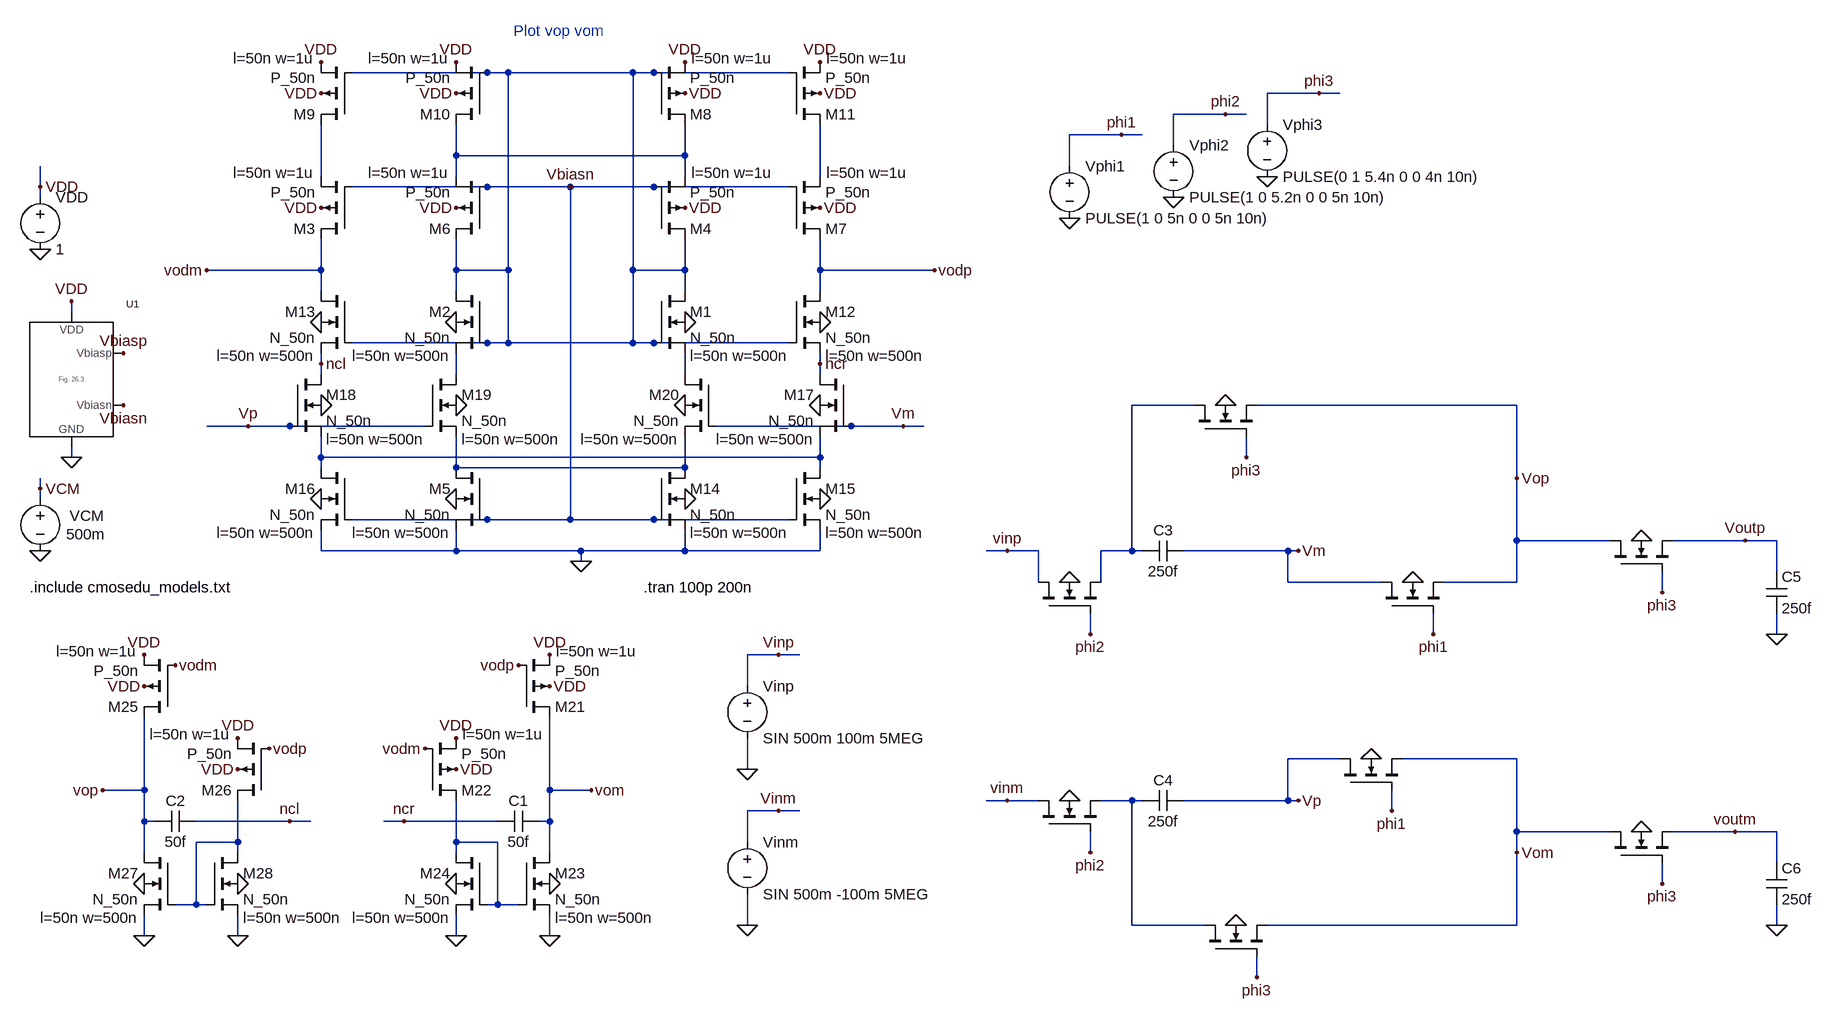
[diagram p0: schematic Fig26_25.asc]
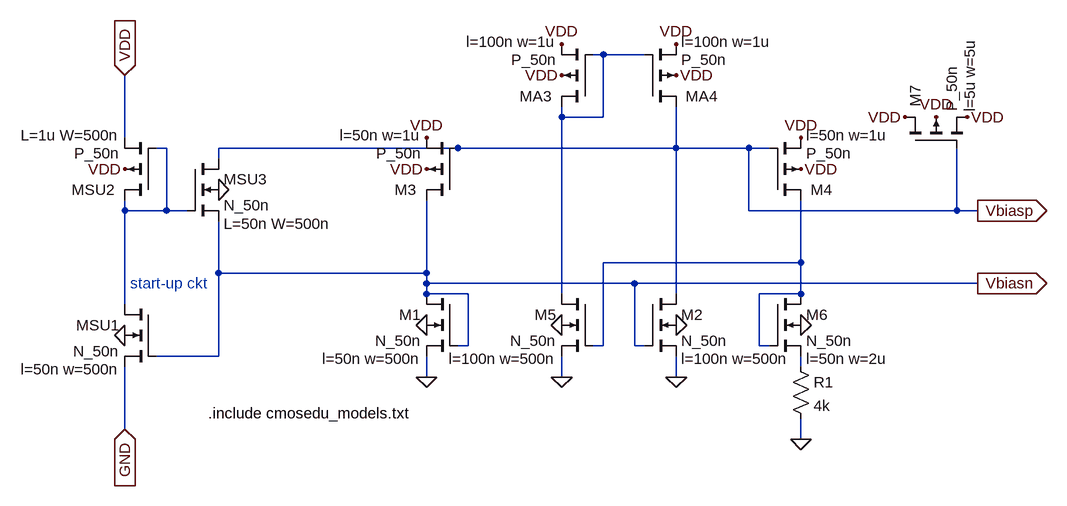
[diagram p1: sub-circuit fig_26_3.asc]
Fig26_25.asc, the LTspice schematic file:
Version 4
SHEET 1 3488 992
WIRE 1440 -544 1232 -544
WIRE 1472 -544 1440 -544
WIRE 1664 -544 1472 -544
WIRE 1696 -544 1664 -544
WIRE 1904 -544 1696 -544
WIRE 2720 -512 2640 -512
WIRE 2752 -512 2720 -512
WIRE 2576 -480 2496 -480
WIRE 2608 -480 2576 -480
WIRE 2640 -464 2640 -512
WIRE 2416 -448 2336 -448
WIRE 2448 -448 2416 -448
WIRE 2496 -432 2496 -480
WIRE 1392 -416 1392 -464
WIRE 1744 -416 1744 -464
WIRE 1744 -416 1392 -416
WIRE 2336 -400 2336 -448
WIRE 1184 -384 1184 -464
WIRE 1392 -384 1392 -416
WIRE 1744 -384 1744 -416
WIRE 1952 -384 1952 -464
WIRE 752 -368 752 -400
WIRE 1440 -368 1232 -368
WIRE 1568 -368 1440 -368
WIRE 1696 -368 1568 -368
WIRE 1904 -368 1696 -368
WIRE 752 -352 752 -368
WIRE 1184 -240 1184 -288
WIRE 1184 -240 1008 -240
WIRE 1392 -240 1392 -288
WIRE 1472 -240 1472 -544
WIRE 1472 -240 1392 -240
WIRE 1664 -240 1664 -544
WIRE 1744 -240 1744 -288
WIRE 1744 -240 1664 -240
WIRE 1952 -240 1952 -288
WIRE 2128 -240 1952 -240
WIRE 1184 -208 1184 -240
WIRE 1392 -208 1392 -240
WIRE 1744 -208 1744 -240
WIRE 1952 -208 1952 -240
WIRE 800 -176 800 -192
WIRE 1440 -128 1232 -128
WIRE 1472 -128 1472 -240
WIRE 1472 -128 1440 -128
WIRE 1664 -128 1664 -240
WIRE 1664 -128 1472 -128
WIRE 1696 -128 1664 -128
WIRE 1904 -128 1696 -128
WIRE 1184 -96 1184 -112
WIRE 1952 -96 1952 -112
WIRE 1184 -80 1184 -96
WIRE 1392 -80 1392 -112
WIRE 1744 -80 1744 -112
WIRE 1952 -80 1952 -96
WIRE 2528 -32 2432 -32
WIRE 3024 -32 2624 -32
WIRE 1072 0 1008 0
WIRE 1136 0 1072 0
WIRE 1344 0 1136 0
WIRE 2000 0 1792 0
WIRE 2080 0 2000 0
WIRE 2112 0 2080 0
WIRE 800 48 800 32
WIRE 1184 48 1184 16
WIRE 1952 48 1952 16
WIRE 1952 48 1184 48
WIRE 2608 48 2608 16
WIRE 1184 64 1184 48
WIRE 1392 64 1392 16
WIRE 1744 64 1744 16
WIRE 1744 64 1392 64
WIRE 1952 64 1952 48
WIRE 3024 80 3024 -32
WIRE 752 96 752 80
WIRE 752 112 752 96
WIRE 1440 144 1232 144
WIRE 1568 144 1568 -368
WIRE 1568 144 1440 144
WIRE 1696 144 1568 144
WIRE 1904 144 1696 144
WIRE 3024 176 3024 80
WIRE 3168 176 3024 176
WIRE 3376 176 3264 176
WIRE 3424 176 3376 176
WIRE 1184 192 1184 160
WIRE 1392 192 1392 160
WIRE 1392 192 1184 192
WIRE 1584 192 1392 192
WIRE 1744 192 1744 160
WIRE 1744 192 1584 192
WIRE 1952 192 1952 160
WIRE 1952 192 1744 192
WIRE 2240 192 2208 192
WIRE 2288 192 2240 192
WIRE 2432 192 2432 -32
WIRE 2432 192 2384 192
WIRE 2448 192 2432 192
WIRE 2672 192 2512 192
WIRE 2688 192 2672 192
WIRE 1584 208 1584 192
WIRE 3424 224 3424 176
WIRE 2288 240 2288 192
WIRE 2384 240 2384 192
WIRE 2672 240 2672 192
WIRE 2816 240 2672 240
WIRE 3024 240 3024 176
WIRE 3024 240 2912 240
WIRE 3248 256 3248 224
WIRE 2368 320 2368 288
WIRE 2896 320 2896 288
WIRE 3424 320 3424 288
WIRE 1888 352 1840 352
WIRE 1920 352 1888 352
WIRE 1840 400 1840 352
WIRE 2752 512 2672 512
WIRE 3024 512 2848 512
WIRE 1840 528 1840 480
WIRE 912 560 912 448
WIRE 912 560 848 560
WIRE 1536 560 1536 448
WIRE 1600 560 1536 560
WIRE 2240 576 2208 576
WIRE 2288 576 2240 576
WIRE 2432 576 2384 576
WIRE 2448 576 2432 576
WIRE 2672 576 2672 512
WIRE 2672 576 2512 576
WIRE 2688 576 2672 576
WIRE 1888 592 1840 592
WIRE 1920 592 1888 592
WIRE 2832 592 2832 560
WIRE 912 608 912 560
WIRE 928 608 912 608
WIRE 1136 608 992 608
WIRE 1168 608 1136 608
WIRE 1312 608 1280 608
WIRE 1456 608 1312 608
WIRE 1536 608 1536 560
WIRE 1536 608 1520 608
WIRE 3024 624 3024 512
WIRE 3168 624 3024 624
WIRE 3360 624 3264 624
WIRE 3424 624 3360 624
WIRE 1056 640 1056 576
WIRE 1056 640 992 640
WIRE 1392 640 1392 576
WIRE 1456 640 1392 640
WIRE 1840 640 1840 592
WIRE 912 656 912 608
WIRE 1056 656 1056 640
WIRE 1392 656 1392 640
WIRE 1536 656 1536 608
WIRE 2368 656 2368 624
WIRE 3024 656 3024 624
WIRE 3424 672 3424 624
WIRE 3248 704 3248 672
WIRE 992 736 992 640
WIRE 992 736 960 736
WIRE 1008 736 992 736
WIRE 1456 736 1456 640
WIRE 1456 736 1440 736
WIRE 1488 736 1456 736
WIRE 1840 768 1840 720
WIRE 2432 768 2432 576
WIRE 2544 768 2432 768
WIRE 3024 768 3024 656
WIRE 3024 768 2640 768
WIRE 3424 768 3424 736
WIRE 912 784 912 752
WIRE 1056 784 1056 752
WIRE 1392 784 1392 752
WIRE 1536 784 1536 752
WIRE 2624 848 2624 816
FLAG 752 -272 0
FLAG 752 -368 VDD
FLAG 1392 -160 0
FLAG 1744 -160 0
FLAG 1744 -336 VDD
FLAG 1184 -336 VDD
FLAG 800 -192 VDD
FLAG 800 48 0
FLAG 752 192 0
FLAG 880 -32 Vbiasn
FLAG 880 -112 Vbiasp
FLAG 752 96 VCM
FLAG 1392 -336 VDD
FLAG 1952 -336 VDD
FLAG 1744 -560 VDD
FLAG 1744 -512 VDD
FLAG 1184 -512 VDD
FLAG 1184 -560 VDD
FLAG 1392 -512 VDD
FLAG 1392 -560 VDD
FLAG 1952 -560 VDD
FLAG 1952 -512 VDD
FLAG 1952 -160 0
FLAG 1184 -160 0
FLAG 1392 112 0
FLAG 1744 112 0
FLAG 1952 112 0
FLAG 1184 112 0
FLAG 1952 -32 0
FLAG 1184 -32 0
FLAG 1392 -32 0
FLAG 1744 -32 0
FLAG 1584 208 0
FLAG 1568 -368 Vbiasn
FLAG 2128 -240 vodp
FLAG 1008 -240 vodm
FLAG 1072 0 Vp
FLAG 2080 0 Vm
FLAG 1952 -96 ncr
FLAG 1184 -96 ncl
FLAG 1536 352 VDD
FLAG 1536 400 VDD
FLAG 1392 480 VDD
FLAG 1392 528 VDD
FLAG 1536 704 0
FLAG 1536 784 0
FLAG 1392 704 0
FLAG 1392 784 0
FLAG 1600 560 vom
FLAG 1312 608 ncr
FLAG 1488 368 vodp
FLAG 1344 496 vodm
FLAG 912 352 VDD
FLAG 912 400 VDD
FLAG 1056 480 VDD
FLAG 1056 528 VDD
FLAG 912 704 0
FLAG 912 784 0
FLAG 1056 704 0
FLAG 1056 784 0
FLAG 848 560 vop
FLAG 1136 608 ncl
FLAG 960 368 vodm
FLAG 1104 496 vodp
FLAG 1840 528 0
FLAG 1888 352 Vinp
FLAG 1840 768 0
FLAG 1888 592 Vinm
FLAG 2336 240 0
FLAG 2368 320 phi2
FLAG 2240 192 vinp
FLAG 2336 576 0
FLAG 2368 656 phi2
FLAG 2240 576 vinm
FLAG 2688 192 Vm
FLAG 2688 576 Vp
FLAG 2576 -32 0
FLAG 2608 48 phi3
FLAG 2592 768 0
FLAG 2624 848 phi3
FLAG 2864 240 0
FLAG 2896 320 phi1
FLAG 2800 512 0
FLAG 2832 592 phi1
FLAG 3024 80 Vop
FLAG 3024 656 Vom
FLAG 3216 176 0
FLAG 3248 256 phi3
FLAG 3216 624 0
FLAG 3248 704 phi3
FLAG 3424 320 0
FLAG 3424 768 0
FLAG 3376 176 Voutp
FLAG 3360 624 voutm
FLAG 2336 -320 0
FLAG 2416 -448 phi1
FLAG 2496 -352 0
FLAG 2576 -480 phi2
FLAG 2640 -384 0
FLAG 2720 -512 phi3
SYMBOL voltage 752 -368 R0
WINDOW 123 0 0 Left 2
WINDOW 39 0 0 Left 2
SYMATTR InstName VDD
SYMATTR Value 1
SYMBOL nmos4 1440 -208 M0
WINDOW 123 56 100 Left 2
SYMATTR Value2 l=50n w=500n
SYMATTR InstName M2
SYMATTR Value N_50n
SYMBOL nmos4 1696 -208 R0
WINDOW 123 56 100 Left 2
SYMATTR Value2 l=50n w=500n
SYMATTR InstName M1
SYMATTR Value N_50n
SYMBOL pmos4 1696 -288 M180
WINDOW 123 58 102 Left 2
WINDOW 0 56 16 Left 2
SYMATTR Value2 l=50n w=1u
SYMATTR InstName M4
SYMATTR Value P_50n
SYMBOL pmos4 1232 -288 R180
WINDOW 123 58 102 Left 2
WINDOW 0 56 16 Left 2
SYMATTR Value2 l=50n w=1u
SYMATTR InstName M3
SYMATTR Value P_50n
SYMBOL voltage 752 96 R0
WINDOW 0 45 42 Left 2
WINDOW 3 40 70 Left 2
WINDOW 123 0 0 Left 2
WINDOW 39 0 0 Left 2
SYMATTR InstName VCM
SYMATTR Value 500m
SYMBOL Fig_26_3 736 -64 R0
SYMATTR InstName U1
SYMBOL pmos4 1440 -288 R180
WINDOW 123 58 102 Left 2
WINDOW 0 56 16 Left 2
SYMATTR Value2 l=50n w=1u
SYMATTR InstName M6
SYMATTR Value P_50n
SYMBOL pmos4 1904 -288 M180
WINDOW 123 58 102 Left 2
WINDOW 0 56 16 Left 2
SYMATTR Value2 l=50n w=1u
SYMATTR InstName M7
SYMATTR Value P_50n
SYMBOL pmos4 1696 -464 M180
WINDOW 123 58 102 Left 2
WINDOW 0 56 16 Left 2
SYMATTR Value2 l=50n w=1u
SYMATTR InstName M8
SYMATTR Value P_50n
SYMBOL pmos4 1232 -464 R180
WINDOW 123 58 102 Left 2
WINDOW 0 56 16 Left 2
SYMATTR Value2 l=50n w=1u
SYMATTR InstName M9
SYMATTR Value P_50n
SYMBOL pmos4 1440 -464 R180
WINDOW 123 58 102 Left 2
WINDOW 0 56 16 Left 2
SYMATTR Value2 l=50n w=1u
SYMATTR InstName M10
SYMATTR Value P_50n
SYMBOL pmos4 1904 -464 M180
WINDOW 123 58 102 Left 2
WINDOW 0 56 16 Left 2
SYMATTR Value2 l=50n w=1u
SYMATTR InstName M11
SYMATTR Value P_50n
SYMBOL nmos4 1904 -208 R0
WINDOW 123 56 100 Left 2
SYMATTR Value2 l=50n w=500n
SYMATTR InstName M12
SYMATTR Value N_50n
SYMBOL nmos4 1232 -208 M0
WINDOW 123 56 100 Left 2
SYMATTR Value2 l=50n w=500n
SYMATTR InstName M13
SYMATTR Value N_50n
SYMBOL nmos4 1440 64 M0
WINDOW 123 56 100 Left 2
SYMATTR Value2 l=50n w=500n
SYMATTR InstName M5
SYMATTR Value N_50n
SYMBOL nmos4 1696 64 R0
WINDOW 123 56 100 Left 2
SYMATTR Value2 l=50n w=500n
SYMATTR InstName M14
SYMATTR Value N_50n
SYMBOL nmos4 1904 64 R0
WINDOW 123 56 100 Left 2
SYMATTR Value2 l=50n w=500n
SYMATTR InstName M15
SYMATTR Value N_50n
SYMBOL nmos4 1232 64 M0
WINDOW 123 56 100 Left 2
SYMATTR Value2 l=50n w=500n
SYMATTR InstName M16
SYMATTR Value N_50n
SYMBOL nmos4 2000 -80 M0
WINDOW 123 56 100 Left 2
SYMATTR Value2 l=50n w=500n
SYMATTR InstName M17
SYMATTR Value N_50n
SYMBOL nmos4 1136 -80 R0
WINDOW 123 56 100 Left 2
SYMATTR Value2 l=50n w=500n
SYMATTR InstName M18
SYMATTR Value N_50n
SYMBOL nmos4 1344 -80 R0
WINDOW 123 56 100 Left 2
SYMATTR Value2 l=50n w=500n
SYMATTR InstName M19
SYMATTR Value N_50n
SYMBOL nmos4 1792 -80 M0
WINDOW 123 56 100 Left 2
SYMATTR Value2 l=50n w=500n
SYMATTR InstName M20
SYMATTR Value N_50n
SYMBOL pmos4 1488 448 M180
WINDOW 123 58 102 Left 2
WINDOW 0 56 16 Left 2
SYMATTR Value2 l=50n w=1u
SYMATTR InstName M21
SYMATTR Value P_50n
SYMBOL pmos4 1344 576 M180
WINDOW 123 58 102 Left 2
WINDOW 0 56 16 Left 2
SYMATTR Value2 l=50n w=1u
SYMATTR InstName M22
SYMATTR Value P_50n
SYMBOL nmos4 1488 656 R0
WINDOW 123 56 100 Left 2
SYMATTR Value2 l=50n w=500n
SYMATTR InstName M23
SYMATTR Value N_50n
SYMBOL nmos4 1440 656 M0
WINDOW 123 56 100 Left 2
SYMATTR Value2 l=50n w=500n
SYMATTR InstName M24
SYMATTR Value N_50n
SYMBOL cap 1520 592 R90
WINDOW 0 0 32 VBottom 2
WINDOW 3 32 32 VTop 2
SYMATTR InstName C1
SYMATTR Value 50f
SYMBOL pmos4 960 448 R180
WINDOW 123 58 102 Left 2
WINDOW 0 56 16 Left 2
SYMATTR Value2 l=50n w=1u
SYMATTR InstName M25
SYMATTR Value P_50n
SYMBOL pmos4 1104 576 R180
WINDOW 123 58 102 Left 2
WINDOW 0 56 16 Left 2
SYMATTR Value2 l=50n w=1u
SYMATTR InstName M26
SYMATTR Value P_50n
SYMBOL nmos4 960 656 M0
WINDOW 123 56 100 Left 2
SYMATTR Value2 l=50n w=500n
SYMATTR InstName M27
SYMATTR Value N_50n
SYMBOL nmos4 1008 656 R0
WINDOW 123 56 100 Left 2
SYMATTR Value2 l=50n w=500n
SYMATTR InstName M28
SYMATTR Value N_50n
SYMBOL cap 928 592 M90
WINDOW 0 0 32 VBottom 2
WINDOW 3 32 32 VTop 2
SYMATTR InstName C2
SYMATTR Value 50f
SYMBOL voltage 1840 384 R0
SYMATTR InstName Vinp
SYMATTR Value SIN 500m 100m 5MEG
SYMBOL voltage 1840 624 R0
SYMATTR InstName Vinm
SYMATTR Value SIN 500m -100m 5MEG
SYMBOL nmos4 2288 288 R270
WINDOW 0 56 32 Invisible 2
WINDOW 3 56 72 Invisible 2
SYMATTR InstName M30
SYMATTR Value N_50n
SYMATTR Value2 l=50n w=500n
SYMBOL cap 2448 176 M90
WINDOW 0 0 32 VBottom 2
WINDOW 3 32 32 VTop 2
SYMATTR InstName C3
SYMATTR Value 250f
SYMBOL nmos4 2288 624 R270
WINDOW 0 56 32 Invisible 2
WINDOW 3 56 72 Invisible 2
SYMATTR InstName M32
SYMATTR Value N_50n
SYMATTR Value2 l=50n w=500n
SYMBOL cap 2448 560 M90
WINDOW 0 0 32 VBottom 2
WINDOW 3 32 32 VTop 2
SYMATTR InstName C4
SYMATTR Value 250f
SYMBOL nmos4 2528 16 R270
WINDOW 0 56 32 Invisible 2
WINDOW 3 56 72 Invisible 2
SYMATTR InstName M34
SYMATTR Value N_50n
SYMATTR Value2 l=50n w=500n
SYMBOL nmos4 2544 816 R270
WINDOW 0 56 32 Invisible 2
WINDOW 3 56 72 Invisible 2
SYMATTR InstName M36
SYMATTR Value N_50n
SYMATTR Value2 l=50n w=500n
SYMBOL nmos4 2816 288 R270
WINDOW 0 56 32 Invisible 2
WINDOW 3 56 72 Invisible 2
SYMATTR InstName M38
SYMATTR Value N_50n
SYMATTR Value2 l=50n w=500n
SYMBOL nmos4 2752 560 R270
WINDOW 0 56 32 Invisible 2
WINDOW 3 56 72 Invisible 2
SYMATTR InstName M40
SYMATTR Value N_50n
SYMATTR Value2 l=50n w=500n
SYMBOL nmos4 3168 224 R270
WINDOW 0 56 32 Invisible 2
WINDOW 3 56 72 Invisible 2
SYMATTR InstName M42
SYMATTR Value N_50n
SYMATTR Value2 l=50n w=500n
SYMBOL nmos4 3168 672 R270
WINDOW 0 56 32 Invisible 2
WINDOW 3 56 72 Invisible 2
SYMATTR InstName M44
SYMATTR Value N_50n
SYMATTR Value2 l=50n w=500n
SYMBOL cap 3408 224 R0
SYMATTR InstName C5
SYMATTR Value 250f
SYMBOL cap 3408 672 R0
SYMATTR InstName C6
SYMATTR Value 250f
SYMBOL voltage 2336 -416 R0
WINDOW 123 0 0 Left 2
WINDOW 39 0 0 Left 2
SYMATTR InstName Vphi1
SYMATTR Value PULSE(1 0 5n 0 0 5n 10n)
SYMBOL voltage 2496 -448 R0
WINDOW 123 0 0 Left 2
WINDOW 39 0 0 Left 2
SYMATTR InstName Vphi2
SYMATTR Value PULSE(1 0 5.2n 0 0 5n 10n)
SYMBOL voltage 2640 -480 R0
WINDOW 123 0 0 Left 2
WINDOW 39 0 0 Left 2
SYMATTR InstName Vphi3
SYMATTR Value PULSE(0 1 5.4n 0 0 4n 10n)
TEXT 736 248 Left 2 !.include cmosedu_models.txt
TEXT 1480 -608 Left 2 ;Plot vop vom
TEXT 1680 248 Left 2 !.tran 100p 200n

fig_26_3.asc, the sub-circuit schematic file:
Version 4
SHEET 1 2004 680
WIRE 1280 -304 1264 -304
WIRE 1344 -304 1280 -304
WIRE 1216 -208 1216 -224
WIRE 1280 -208 1280 -304
WIRE 1280 -208 1216 -208
WIRE 544 -176 544 -272
WIRE 608 -160 592 -160
WIRE 1056 -160 688 -160
WIRE 1392 -160 1392 -224
WIRE 1392 -160 1056 -160
WIRE 1504 -160 1392 -160
WIRE 1536 -160 1504 -160
WIRE 688 -144 688 -160
WIRE 544 -64 544 -80
WIRE 608 -64 608 -160
WIRE 608 -64 544 -64
WIRE 640 -64 608 -64
WIRE 1504 -64 1504 -160
WIRE 1824 -64 1824 -160
WIRE 1824 -64 1504 -64
WIRE 1856 -64 1824 -64
WIRE 1584 16 1584 -80
WIRE 1584 16 1280 16
WIRE 688 32 688 -48
WIRE 1008 32 1008 -80
WIRE 1008 32 688 32
WIRE 1008 48 1008 32
WIRE 1328 48 1008 48
WIRE 1856 48 1328 48
WIRE 1008 64 1008 48
WIRE 1072 64 1008 64
WIRE 1216 64 1216 -208
WIRE 1392 64 1392 -160
WIRE 1584 64 1584 16
WIRE 1584 64 1520 64
WIRE 544 80 544 -64
WIRE 1072 144 1072 64
WIRE 1072 144 1056 144
WIRE 1280 144 1280 16
WIRE 1280 144 1264 144
WIRE 1328 144 1328 48
WIRE 1344 144 1328 144
WIRE 1520 144 1520 64
WIRE 1536 144 1520 144
WIRE 688 160 688 32
WIRE 688 160 592 160
WIRE 1584 176 1584 160
WIRE 1008 192 1008 160
WIRE 1216 192 1216 160
WIRE 1392 192 1392 160
WIRE 544 272 544 176
WIRE 1584 288 1584 256
FLAG 544 -128 VDD
FLAG 1008 -128 VDD
FLAG 1008 -176 VDD
FLAG 1584 -128 VDD
FLAG 1584 -176 VDD
FLAG 1584 288 0
FLAG 1584 112 0
FLAG 1392 -272 VDD
FLAG 1392 -320 VDD
FLAG 1216 -272 VDD
FLAG 1216 -320 VDD
FLAG 1392 112 0
FLAG 1792 -208 VDD
FLAG 1744 -208 VDD
FLAG 1840 -208 VDD
FLAG 544 -272 VDD
IOPIN 544 -272 In
FLAG 544 272 GND
IOPIN 544 272 In
FLAG 688 -96 0
FLAG 544 128 0
FLAG 1008 192 0
FLAG 1008 112 0
FLAG 1216 112 0
FLAG 1216 192 0
FLAG 1392 192 0
FLAG 1856 -64 Vbiasp
IOPIN 1856 -64 Out
FLAG 1856 48 Vbiasn
IOPIN 1856 48 Out
SYMBOL pmos4 592 -80 R180
WINDOW 0 63 16 Left 2
WINDOW 123 56 100 Left 2
SYMATTR InstName MSU2
SYMATTR Value2 L=1u W=500n
SYMATTR Value P_50n
SYMBOL nmos4 592 80 M0
WINDOW 123 56 100 Left 2
SYMATTR Value2 l=50n w=500n
SYMATTR InstName MSU1
SYMATTR Value N_50n
SYMBOL nmos4 640 -144 R0
WINDOW 123 56 100 Left 2
SYMATTR Value2 L=50n W=500n
SYMATTR InstName MSU3
SYMATTR Value N_50n
SYMBOL pmos4 1056 -80 R180
WINDOW 0 63 16 Left 2
WINDOW 123 56 100 Left 2
SYMATTR InstName M3
SYMATTR Value2 l=50n w=1u
SYMATTR Value P_50n
SYMBOL pmos4 1536 -80 M180
WINDOW 0 63 16 Left 2
WINDOW 123 56 100 Left 2
SYMATTR InstName M4
SYMATTR Value2 l=50n w=1u
SYMATTR Value P_50n
SYMBOL nmos4 1056 64 M0
WINDOW 123 56 100 Left 2
SYMATTR Value2 l=50n w=500n
SYMATTR InstName M1
SYMATTR Value N_50n
SYMBOL res 1568 160 R0
SYMATTR InstName R1
SYMATTR Value 4k
SYMBOL pmos4 1344 -224 M180
WINDOW 0 63 16 Left 2
WINDOW 123 56 100 Left 2
SYMATTR InstName MA4
SYMATTR Value2 l=100n w=1u
SYMATTR Value P_50n
SYMBOL pmos4 1264 -224 R180
WINDOW 0 63 16 Left 2
WINDOW 123 56 100 Left 2
SYMATTR InstName MA3
SYMATTR Value2 l=100n w=1u
SYMATTR Value P_50n
SYMBOL nmos4 1264 64 M0
WINDOW 123 56 100 Left 2
SYMATTR Value2 l=100n w=500n
SYMATTR InstName M5
SYMATTR Value N_50n
SYMBOL pmos4 1744 -160 R270
WINDOW 0 63 16 Left 2
WINDOW 123 56 100 Left 2
SYMATTR InstName M7
SYMATTR Value2 l=5u w=5u
SYMATTR Value P_50n
SYMBOL nmos4 1344 64 R0
WINDOW 123 56 100 Left 2
SYMATTR Value2 l=100n w=500n
SYMATTR InstName M2
SYMATTR Value N_50n
SYMBOL nmos4 1536 64 R0
WINDOW 123 56 100 Left 2
SYMATTR Value2 l=50n w=2u
SYMATTR InstName M6
SYMATTR Value N_50n
TEXT 552 48 Left 2 ;start-up ckt
TEXT 672 248 Left 2 !.include cmosedu_models.txt

The netlist it stands for:
* Fig26_25.asc
VDD VDD 0 1
M2 N001 N001 N005 0 N_50n l=50n w=500n
M1 N001 N001 N006 0 N_50n l=50n w=500n
M4 N001 Vbiasn N002 VDD P_50n l=50n w=1u
M3 vodm Vbiasn N003 VDD P_50n l=50n w=1u
VCM VCM 0 500m
XU1 Vbiasn Vbiasp VDD 0 fig_26_3
M6 N001 Vbiasn N002 VDD P_50n l=50n w=1u
M7 vodp Vbiasn N004 VDD P_50n l=50n w=1u
M8 N002 N001 VDD VDD P_50n l=50n w=1u
M9 N003 N001 VDD VDD P_50n l=50n w=1u
M10 N002 N001 VDD VDD P_50n l=50n w=1u
M11 N004 N001 VDD VDD P_50n l=50n w=1u
M12 vodp N001 ncr 0 N_50n l=50n w=500n
M13 vodm N001 ncl 0 N_50n l=50n w=500n
M5 N009 Vbiasn 0 0 N_50n l=50n w=500n
M14 N009 Vbiasn 0 0 N_50n l=50n w=500n
M15 N008 Vbiasn 0 0 N_50n l=50n w=500n
M16 N008 Vbiasn 0 0 N_50n l=50n w=500n
M17 ncr Vm N008 0 N_50n l=50n w=500n
M18 ncl Vp N008 0 N_50n l=50n w=500n
M19 N005 Vp N009 0 N_50n l=50n w=500n
M20 N006 Vm N009 0 N_50n l=50n w=500n
M21 vom vodp VDD VDD P_50n l=50n w=1u
M22 N012 vodm VDD VDD P_50n l=50n w=1u
M23 vom N012 0 0 N_50n l=50n w=500n
M24 N012 N012 0 0 N_50n l=50n w=500n
C1 vom ncr 50f
M25 vop vodm VDD VDD P_50n l=50n w=1u
M26 N011 vodp VDD VDD P_50n l=50n w=1u
M27 vop N011 0 0 N_50n l=50n w=500n
M28 N011 N011 0 0 N_50n l=50n w=500n
C2 vop ncl 50f
Vinp Vinp 0 SIN 500m 100m 5MEG
Vinm Vinm 0 SIN 500m -100m 5MEG
M30 Vinp phi2 N007 0 N_50n l=50n w=500n
C3 N007 Vm 250f
M32 Vinm phi2 N010 0 N_50n l=50n w=500n
C4 N010 Vp 250f
M34 N007 phi3 vop 0 N_50n l=50n w=500n
M36 N010 phi3 vom 0 N_50n l=50n w=500n
M38 Vm phi1 vop 0 N_50n l=50n w=500n
M40 Vp phi1 vom 0 N_50n l=50n w=500n
M42 vop phi3 Voutp 0 N_50n l=50n w=500n
M44 vom phi3 voutm 0 N_50n l=50n w=500n
C5 Voutp 0 250f
C6 voutm 0 250f
Vphi1 phi1 0 PULSE(1 0 5n 0 0 5n 10n)
Vphi2 phi2 0 PULSE(1 0 5.2n 0 0 5n 10n)
Vphi3 phi3 0 PULSE(0 1 5.4n 0 0 4n 10n)

* block symbol definitions
.subckt fig_26_3 Vbiasn Vbiasp VDD GND
MSU2 N002 N002 VDD VDD P_50n L=1u W=500n
MSU1 N002 Vbiasn GND 0 N_50n l=50n w=500n
MSU3 Vbiasp N002 Vbiasn 0 N_50n L=50n W=500n
M3 Vbiasn Vbiasp VDD VDD P_50n l=50n w=1u
M4 N003 Vbiasp VDD VDD P_50n l=50n w=1u
M1 Vbiasn Vbiasn 0 0 N_50n l=50n w=500n
R1 N004 0 4k
MA4 Vbiasp N001 VDD VDD P_50n l=100n w=1u
MA3 N001 N001 VDD VDD P_50n l=100n w=1u
M5 N001 N003 0 0 N_50n l=100n w=500n
M7 VDD Vbiasp VDD VDD P_50n l=5u w=5u
M2 Vbiasp Vbiasn 0 0 N_50n l=100n w=500n
M6 N003 N003 N004 0 N_50n l=50n w=2u
* start-up ckt
.include cmosedu_models.txt
.ends fig_26_3

.model NMOS NMOS
.model PMOS PMOS
.lib standard.mos
.include cmosedu_models.txt
* Plot vop vom
.tran 100p 200n
.backanno
.end